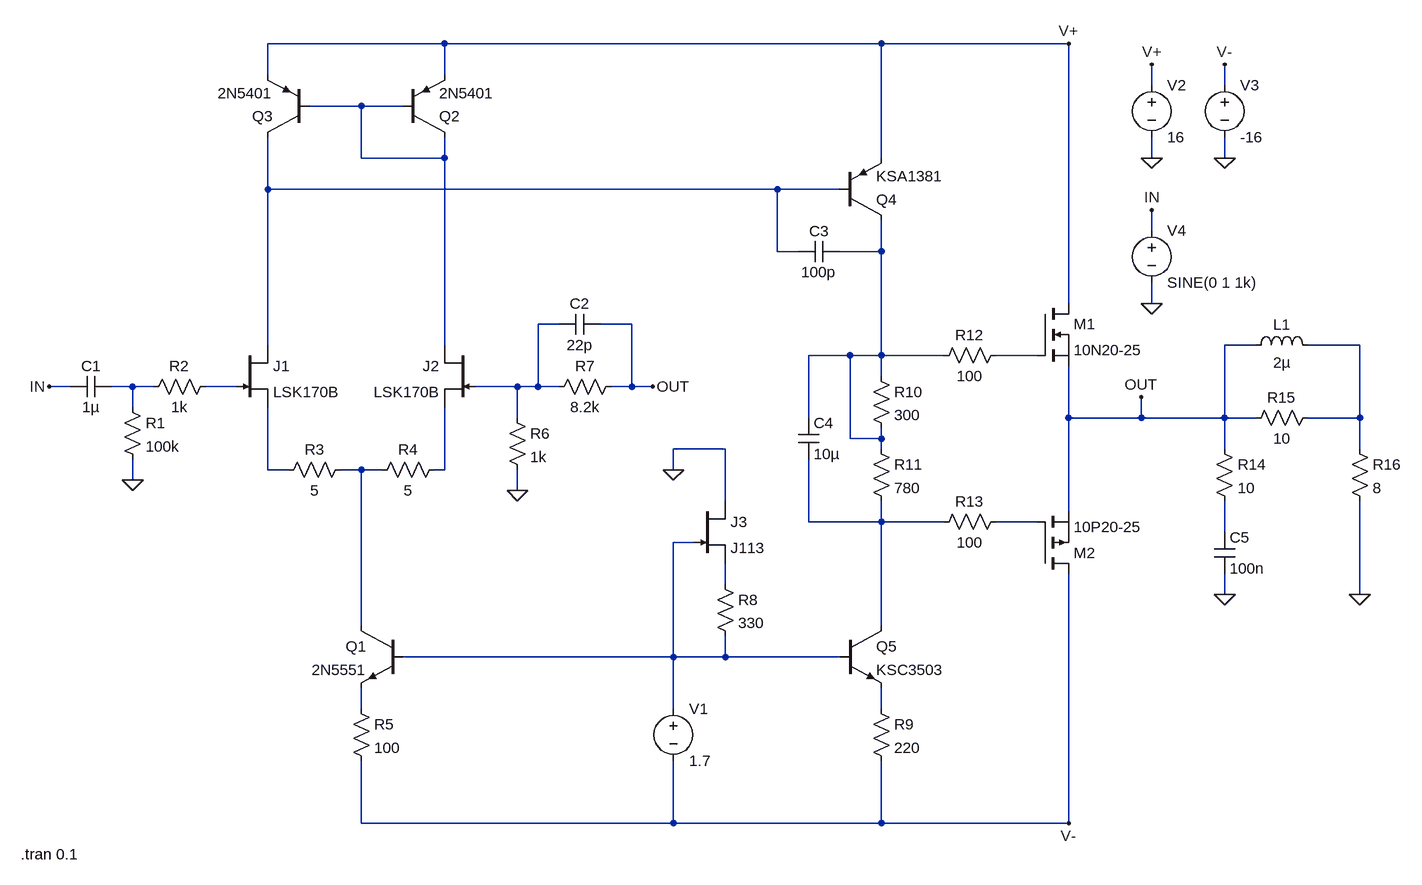
[diagram p0: schematic JFET_Mos.asc]
JFET_Mos.asc, the LTspice schematic file:
Version 4
SHEET 1 2116 864
WIRE 640 -400 368 -400
WIRE 1312 -400 640 -400
WIRE 1600 -400 1312 -400
WIRE 368 -352 368 -400
WIRE 640 -352 640 -400
WIRE 1728 -336 1728 -368
WIRE 1840 -336 1840 -368
WIRE 512 -304 432 -304
WIRE 576 -304 512 -304
WIRE 512 -224 512 -304
WIRE 640 -224 640 -256
WIRE 640 -224 512 -224
WIRE 1312 -224 1312 -400
WIRE 1728 -224 1728 -256
WIRE 1840 -224 1840 -256
WIRE 368 -176 368 -256
WIRE 1152 -176 368 -176
WIRE 1248 -176 1152 -176
WIRE 1728 -112 1728 -144
WIRE 1152 -80 1152 -176
WIRE 1184 -80 1152 -80
WIRE 1312 -80 1312 -128
WIRE 1312 -80 1248 -80
WIRE 1600 0 1600 -400
WIRE 1728 0 1728 -32
WIRE 816 32 784 32
WIRE 928 32 880 32
WIRE 368 64 368 -176
WIRE 640 64 640 -224
WIRE 1888 64 1840 64
WIRE 2048 64 1968 64
WIRE 1264 80 1200 80
WIRE 1312 80 1312 -80
WIRE 1312 80 1264 80
WIRE 1408 80 1312 80
WIRE 1552 80 1488 80
WIRE 1312 112 1312 80
WIRE 64 128 32 128
WIRE 160 128 128 128
WIRE 192 128 160 128
WIRE 320 128 272 128
WIRE 752 128 688 128
WIRE 784 128 784 32
WIRE 784 128 752 128
WIRE 816 128 784 128
WIRE 928 128 928 32
WIRE 928 128 896 128
WIRE 960 128 928 128
WIRE 160 160 160 128
WIRE 752 176 752 128
WIRE 1200 176 1200 80
WIRE 1600 176 1600 96
WIRE 1712 176 1712 144
WIRE 1712 176 1600 176
WIRE 1840 176 1840 64
WIRE 1840 176 1712 176
WIRE 1888 176 1840 176
WIRE 2048 176 2048 64
WIRE 2048 176 1968 176
WIRE 1264 208 1264 80
WIRE 1312 208 1312 192
WIRE 1312 208 1264 208
WIRE 1072 224 992 224
WIRE 1312 224 1312 208
WIRE 1840 224 1840 176
WIRE 2048 224 2048 176
WIRE 368 256 368 160
WIRE 400 256 368 256
WIRE 512 256 480 256
WIRE 544 256 512 256
WIRE 640 256 640 160
WIRE 640 256 624 256
WIRE 992 256 992 224
WIRE 160 272 160 240
WIRE 752 288 752 256
WIRE 1072 304 1072 224
WIRE 1600 320 1600 176
WIRE 1200 336 1200 240
WIRE 1312 336 1312 304
WIRE 1312 336 1200 336
WIRE 1408 336 1312 336
WIRE 1552 336 1488 336
WIRE 1840 352 1840 304
WIRE 1024 368 992 368
WIRE 1072 432 1072 400
WIRE 1840 448 1840 416
WIRE 2048 448 2048 304
WIRE 512 496 512 256
WIRE 1312 496 1312 336
WIRE 992 544 992 368
WIRE 992 544 576 544
WIRE 1072 544 1072 512
WIRE 1072 544 992 544
WIRE 1248 544 1072 544
WIRE 512 624 512 592
WIRE 992 624 992 544
WIRE 1312 624 1312 592
WIRE 512 800 512 704
WIRE 992 800 992 704
WIRE 992 800 512 800
WIRE 1312 800 1312 704
WIRE 1312 800 992 800
WIRE 1600 800 1600 416
WIRE 1600 800 1312 800
FLAG 160 272 0
FLAG 32 128 IN
FLAG 752 288 0
FLAG 960 128 OUT
FLAG 992 256 0
FLAG 1712 144 OUT
FLAG 1840 448 0
FLAG 2048 448 0
FLAG 1840 -224 0
FLAG 1728 -224 0
FLAG 1728 -368 V+
FLAG 1840 -368 V-
FLAG 1600 -400 V+
FLAG 1600 800 V-
FLAG 1728 -144 IN
FLAG 1728 0 0
SYMBOL cap 128 112 R90
WINDOW 0 0 32 VBottom 2
WINDOW 3 32 32 VTop 2
SYMATTR InstName C1
SYMATTR Value 1µ
SYMBOL res 144 144 R0
SYMATTR InstName R1
SYMATTR Value 100k
SYMBOL res 288 112 R90
WINDOW 0 0 56 VBottom 2
WINDOW 3 32 56 VTop 2
SYMATTR InstName R2
SYMATTR Value 1k
SYMBOL njf 320 64 R0
SYMATTR InstName J1
SYMATTR Value LSK170B
SYMBOL njf 688 64 M0
SYMATTR InstName J2
SYMATTR Value LSK170B
SYMBOL res 496 240 R90
WINDOW 0 0 56 VBottom 2
WINDOW 3 32 56 VTop 2
SYMATTR InstName R3
SYMATTR Value 5
SYMBOL res 640 240 R90
WINDOW 0 0 56 VBottom 2
WINDOW 3 32 56 VTop 2
SYMATTR InstName R4
SYMATTR Value 5
SYMBOL npn 576 496 M0
SYMATTR InstName Q1
SYMATTR Value 2N5551
SYMBOL res 496 608 R0
SYMATTR InstName R5
SYMATTR Value 100
SYMBOL pnp 432 -256 R180
SYMATTR InstName Q3
SYMATTR Value 2N5401
SYMBOL res 736 160 R0
SYMATTR InstName R6
SYMATTR Value 1k
SYMBOL res 912 112 R90
WINDOW 0 0 56 VBottom 2
WINDOW 3 32 56 VTop 2
SYMATTR InstName R7
SYMATTR Value 8.2k
SYMBOL cap 880 16 R90
WINDOW 0 0 32 VBottom 2
WINDOW 3 32 32 VTop 2
SYMATTR InstName C2
SYMATTR Value 22p
SYMBOL njf 1024 304 R0
SYMATTR InstName J3
SYMATTR Value J113
SYMBOL res 1056 416 R0
SYMATTR InstName R8
SYMATTR Value 330
SYMBOL pnp 576 -256 M180
SYMATTR InstName Q2
SYMATTR Value 2N5401
SYMBOL pnp 1248 -128 M180
SYMATTR InstName Q4
SYMATTR Value KSA1381
SYMBOL cap 1248 -96 R90
WINDOW 0 0 32 VBottom 2
WINDOW 3 32 32 VTop 2
SYMATTR InstName C3
SYMATTR Value 100p
SYMBOL npn 1248 496 R0
SYMATTR InstName Q5
SYMATTR Value KSC3503
SYMBOL res 1296 608 R0
SYMATTR InstName R9
SYMATTR Value 220
SYMBOL nmos 1552 0 R0
SYMATTR InstName M1
SYMATTR Value 10N20-25
SYMBOL pmos 1552 416 M180
SYMATTR InstName M2
SYMATTR Value 10P20-25
SYMBOL res 1296 96 R0
SYMATTR InstName R10
SYMATTR Value 300
SYMBOL res 1296 208 R0
SYMATTR InstName R11
SYMATTR Value 780
SYMBOL cap 1184 176 R0
SYMATTR InstName C4
SYMATTR Value 10µ
SYMBOL res 1504 64 R90
WINDOW 0 0 56 VBottom 2
WINDOW 3 32 56 VTop 2
SYMATTR InstName R12
SYMATTR Value 100
SYMBOL res 1504 320 R90
WINDOW 0 0 56 VBottom 2
WINDOW 3 32 56 VTop 2
SYMATTR InstName R13
SYMATTR Value 100
SYMBOL res 1824 208 R0
SYMATTR InstName R14
SYMATTR Value 10
SYMBOL cap 1824 352 R0
SYMATTR InstName C5
SYMATTR Value 100n
SYMBOL res 1984 160 R90
WINDOW 0 0 56 VBottom 2
WINDOW 3 32 56 VTop 2
SYMATTR InstName R15
SYMATTR Value 10
SYMBOL ind 1872 80 R270
WINDOW 0 32 56 VTop 2
WINDOW 3 5 56 VBottom 2
SYMATTR InstName L1
SYMATTR Value 2µ
SYMBOL res 2032 208 R0
SYMATTR InstName R16
SYMATTR Value 8
SYMBOL voltage 1728 -352 R0
WINDOW 123 0 0 Left 0
WINDOW 39 0 0 Left 0
SYMATTR InstName V2
SYMATTR Value 16
SYMBOL voltage 1840 -352 R0
WINDOW 123 0 0 Left 0
WINDOW 39 0 0 Left 0
SYMATTR InstName V3
SYMATTR Value -16
SYMBOL voltage 1728 -128 R0
WINDOW 123 0 0 Left 0
WINDOW 39 0 0 Left 0
SYMATTR InstName V4
SYMATTR Value SINE(0 1 1k)
SYMBOL voltage 992 608 R0
WINDOW 123 0 0 Left 0
WINDOW 39 0 0 Left 0
SYMATTR InstName V1
SYMATTR Value 1.7
TEXT -12 848 Left 2 !.tran 0.1

The netlist it stands for:
* JFET_Mos.asc
C1 N007 IN 1µ
R1 N007 0 100k
R2 N008 N007 1k
J1 N002 N008 N009 LSK170B
J2 N001 N004 N011 LSK170B
R3 N010 N009 5
R4 N011 N010 5
Q1 N010 N015 N017 0 2N5551
R5 N017 V- 100
Q3 N002 N001 V+ 0 2N5401
R6 N004 0 1k
R7 OUT N004 8.2k
C2 OUT N004 22p
J3 0 N015 N016 J113
R8 N016 N015 330
Q2 N001 N001 V+ 0 2N5401
Q4 N003 N002 V+ 0 KSA1381
C3 N003 N002 100p
Q5 N012 N015 N018 0 KSC3503
R9 N018 V- 220
M1 V+ N006 OUT OUT 10N20-25
M2 V- N013 OUT OUT 10P20-25
R10 N003 N003 300
R11 N003 N012 780
C4 N003 N012 10µ
R12 N006 N003 100
R13 N013 N012 100
R14 OUT N014 10
C5 N014 0 100n
R15 N005 OUT 10
L1 OUT N005 2µ
R16 N005 0 8
V2 V+ 0 16
V3 V- 0 -16
V4 IN 0 SINE(0 1 1k)
V1 N015 V- 1.7
.model NPN NPN
.model PNP PNP
.lib standard.bjt
.model NJF NJF
.model PJF PJF
.lib standard.jft
.model NMOS NMOS
.model PMOS PMOS
.lib standard.mos
.tran 0.1
.backanno
.end